# EAGLE schematic scheme (EAGLE 9.7.0)
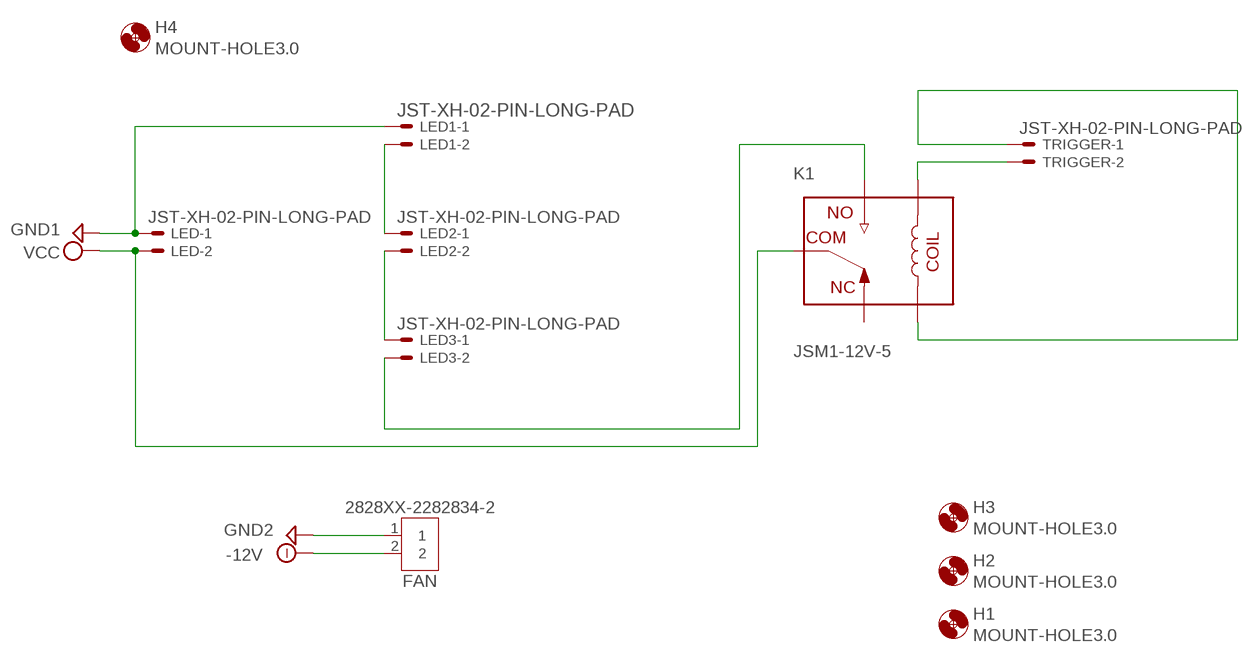
[diagram p0: schematic, sheet 1]

## Parts
FAN  2828XX-2282834-2  [TERMBLK_254-2N]
H1  MOUNT-HOLE3.0  [3,0]
H2  MOUNT-HOLE3.0  [3,0]
H3  MOUNT-HOLE3.0  [3,0]
H4  MOUNT-HOLE3.0  [3,0]
K1  JSM1-12V-5  [JSM1-12V-5]
LED  JST-XH-02-PIN-LONG-PAD  [JST-XH-02-PACKAGE-LONG-PAD]
LED1  JST-XH-02-PIN-LONG-PAD  [JST-XH-02-PACKAGE-LONG-PAD]
LED2  JST-XH-02-PIN-LONG-PAD  [JST-XH-02-PACKAGE-LONG-PAD]
LED3  JST-XH-02-PIN-LONG-PAD  [JST-XH-02-PACKAGE-LONG-PAD]
TRIGGER  JST-XH-02-PIN-LONG-PAD  [JST-XH-02-PACKAGE-LONG-PAD]

## Nets
-12V: FAN.2
GND1: LED1.1 LED.1
GND2: FAN.1
N$1: LED1.2 LED2.1
N$2: K1.2 TRIGGER.2
N$3: K1.3 LED3.2
N$4: K1.5 TRIGGER.1
N$6: LED2.2 LED3.1
VCC: K1.1 LED.2
Unconnected: K1.4

## Library data of the parts
FAN = Connector:2828XX-2: 2 Position Wire to Board Terminal Block Horizontal with Board Datasheet <https://www.te.com.cn/commerce/DocumentDelivery/DDEController?Action=showdoc&DocId=Catalog+Section%7F1308389_EUROSTYLE_TERMINAL_BLOCKS%7F0607%7Fpdf%7FEnglish%7FENG_CS_1308389_EUROSTYLE_TERMINAL_BLOCKS_0607.pdf%7F2-282837-5>
H1-H4 = holes:MOUNT-HOLE: MOUNTING HOLE with drill center marker
K1 = Relay:JSM1-12V-5: RELAY AUTOMOTIVE SPDT 15A 12V Manufacturer's datasheet <https://media.digikey.com/pdf/Data%20Sheets/Panasonic%20Electric%20Works%20PDFs/JS-M_Series_Rev_Dec_2011.pdf>; CREATED_BY: PCBLayout.com; DIGIKEY_PARTNO: 255-1240-ND; MANUFACTURER: Panasonic Electric Works; MPN: JSM1-12V-5
LED LED1-LED3 = Rembrandt Electronics - JST XH Connectors v1-0:JST-XH-02-PIN: JST XH Connector 2 Pin Wire to board connector. Pitch: 2,54 mm, (0.100") Number of pins: 2 Created by Rembrandt Electronics www.rembrandtelectronics.com
TRIGGER = Rembrandt Electronics - JST XH Connectors v1-0:JST-XH-02-PIN: JST XH Connector 2 Pin Wire to board connector. Pitch: 2,54 mm, (0.100") Number of pins: 2 Created by Rembrandt Electronics www.rembrandtelectronics.com; TRIGGER: 1